# EAGLE schematic bontor_mbed_lowpan_rev_h (EAGLE 7.2.0)
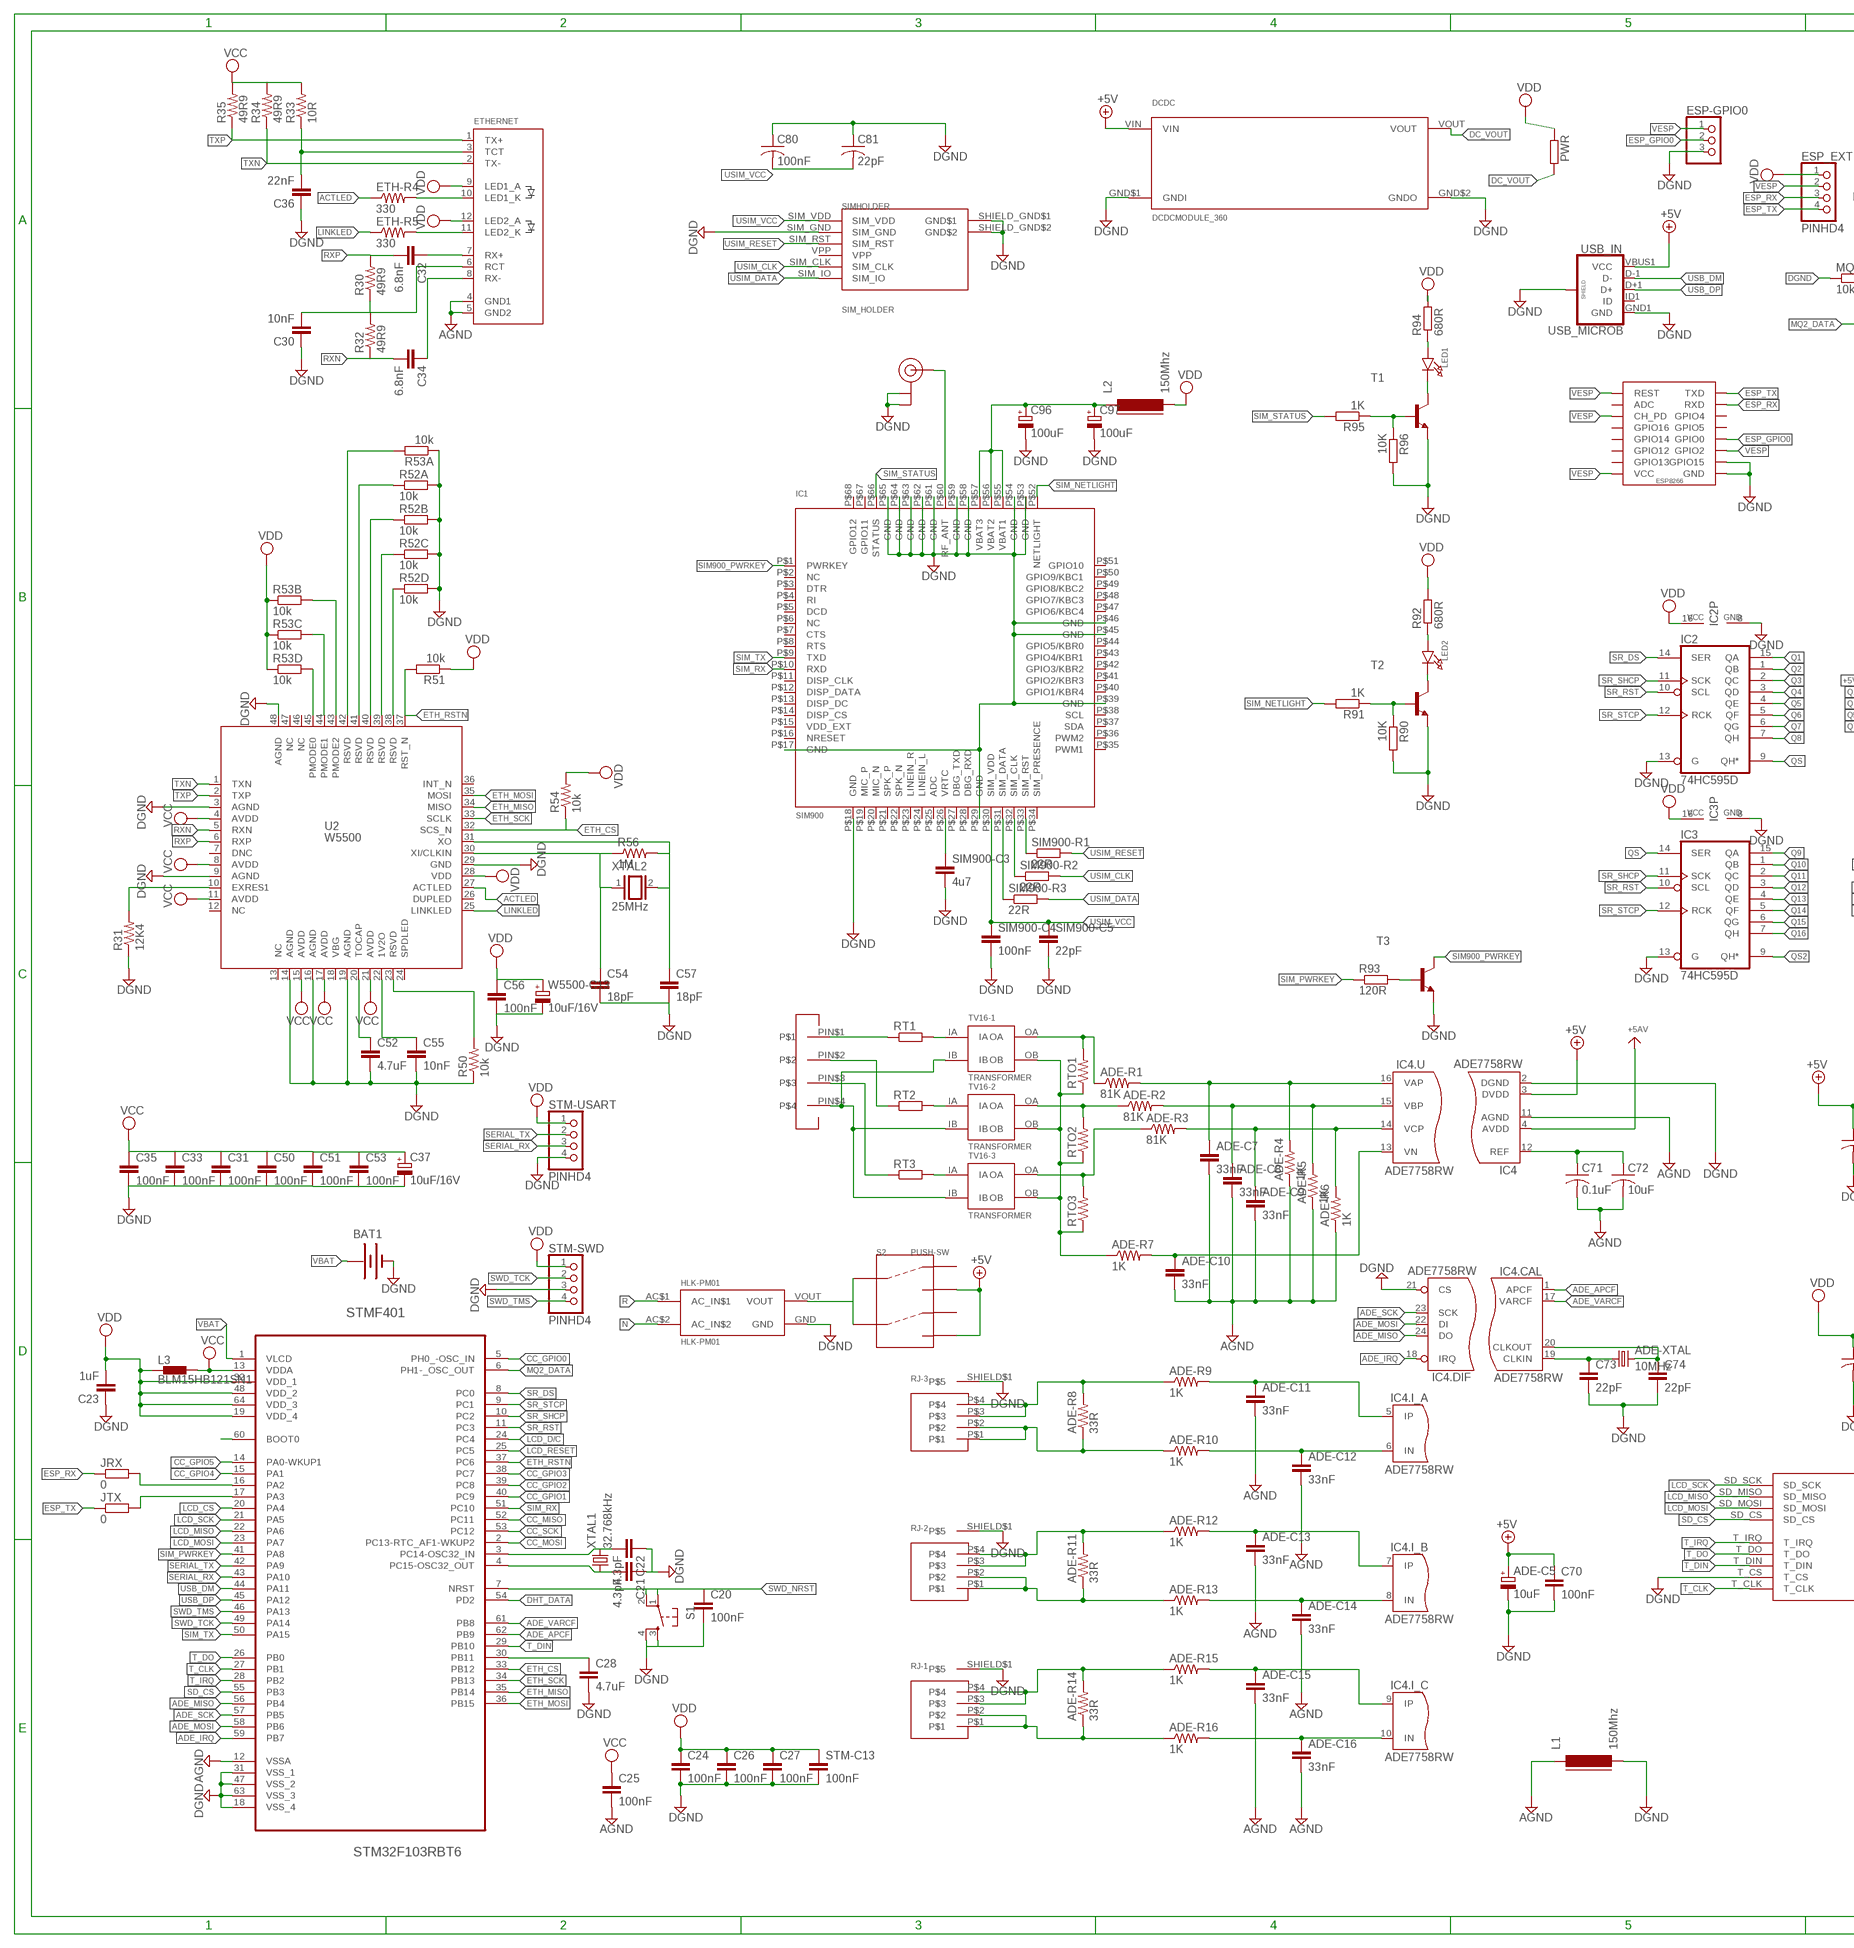
[diagram p0: schematic, sheet 1, part 1 of 2]
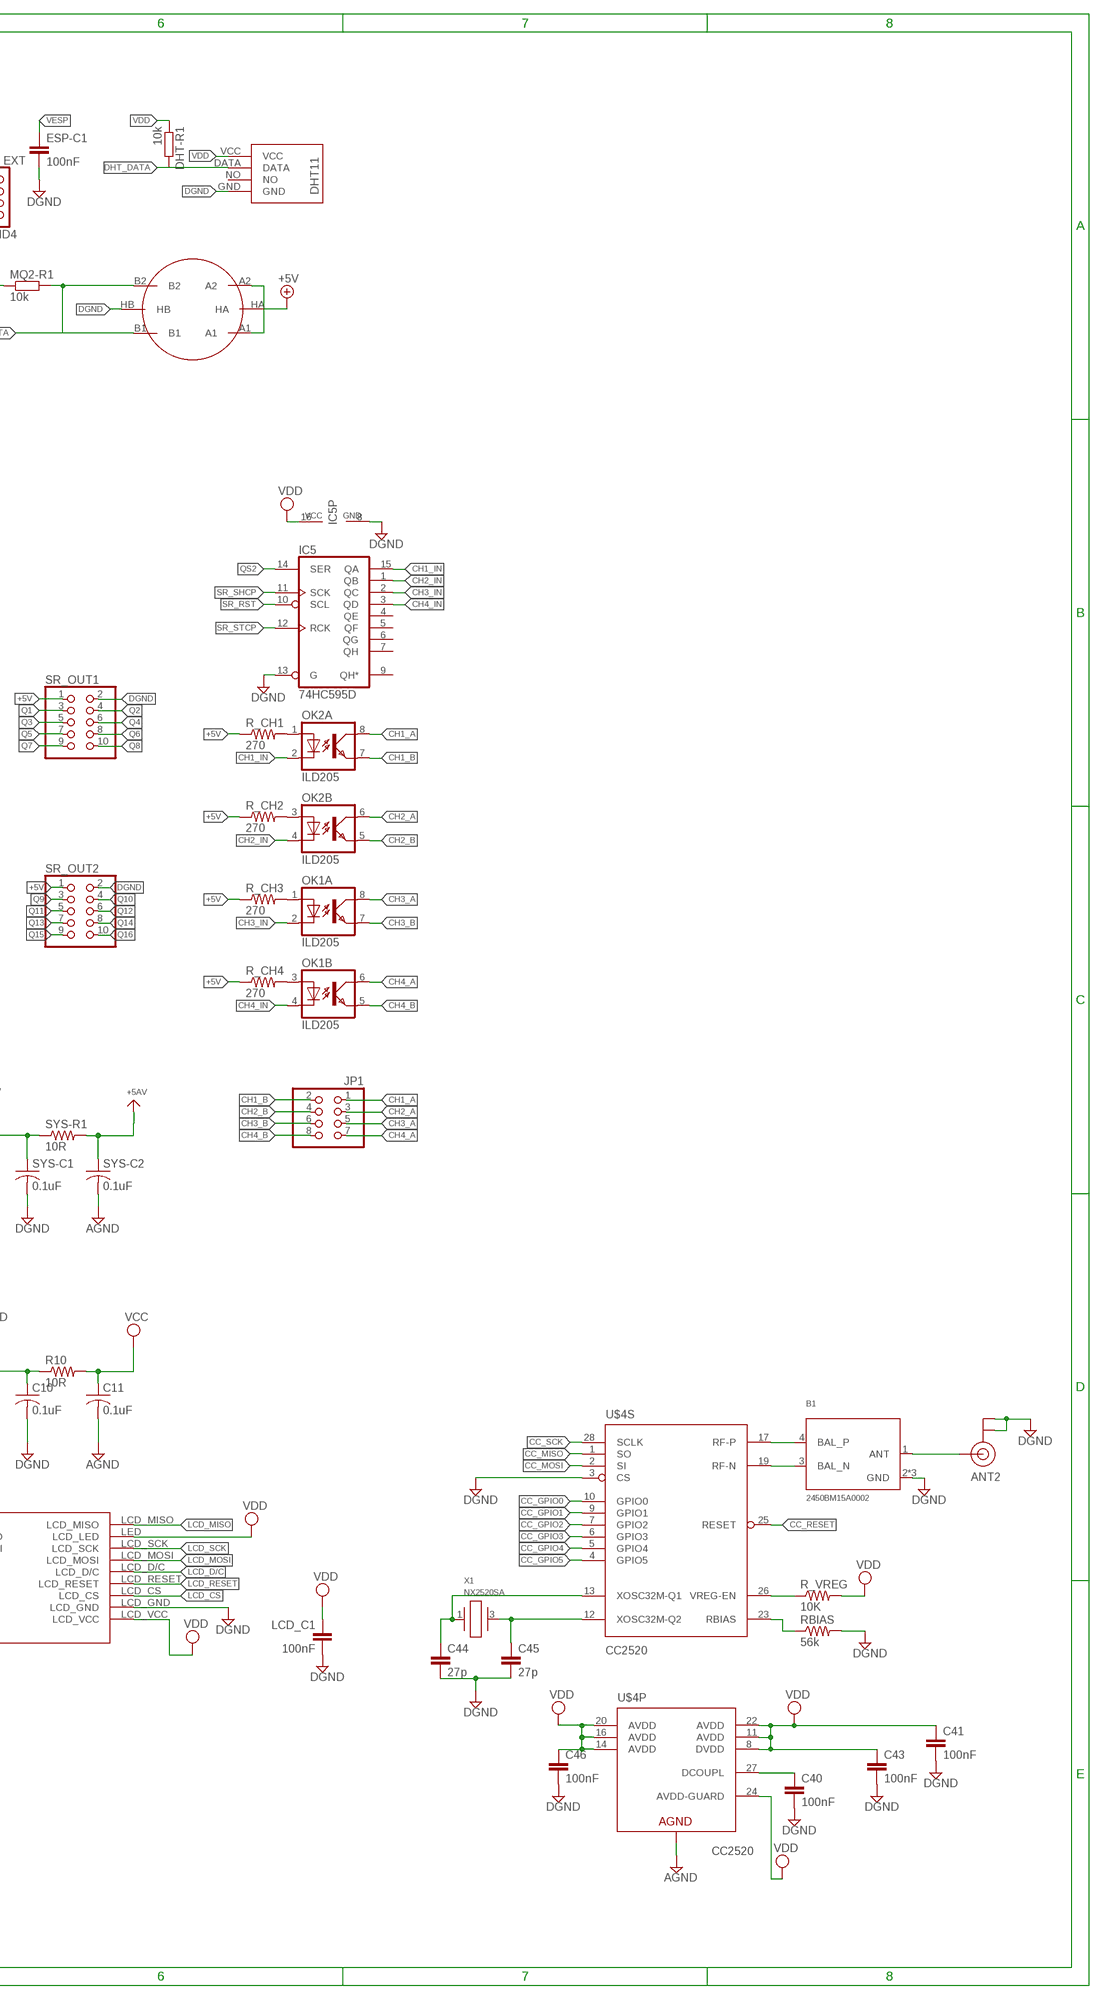
[diagram p1: schematic, sheet 1, part 2 of 2]

## Parts
ADE-C5  10uF  CPOL-EU153CLV-0605  [153CLV-0605]
ADE-C7  33nF  CAP0603-CAP  [0603-CAP]
ADE-C8  33nF  CAP0603-CAP  [0603-CAP]
ADE-C9  33nF  CAP0603-CAP  [0603-CAP]
ADE-C10  33nF  CAP0603-CAP  [0603-CAP]
ADE-C11  33nF  CAP0402-CAP  [0402-CAP]
ADE-C12  33nF  CAP0402-CAP  [0402-CAP]
ADE-C13  33nF  CAP0402-CAP  [0402-CAP]
ADE-C14  33nF  CAP0402-CAP  [0402-CAP]
ADE-C15  33nF  CAP0402-CAP  [0402-CAP]
ADE-C16  33nF  CAP0402-CAP  [0402-CAP]
ADE-R1  81K  RESISTOR0603-RES  [0603-RES]
ADE-R2  81K  RESISTOR0603-RES  [0603-RES]
ADE-R3  81K  RESISTOR0603-RES  [0603-RES]
ADE-R4  1K  RESISTOR0603-RES  [0603-RES]
ADE-R5  1K  RESISTOR0603-RES  [0603-RES]
ADE-R6  1K  RESISTOR0603-RES  [0603-RES]
ADE-R7  1K  RESISTOR0603-RES  [0603-RES]
ADE-R8  33R  RESISTOR0402-RES  [0402-RES]
ADE-R9  1K  RESISTOR0402-RES  [0402-RES]
ADE-R10  1K  RESISTOR0402-RES  [0402-RES]
ADE-R11  33R  RESISTOR0402-RES  [0402-RES]
ADE-R12  1K  RESISTOR0402-RES  [0402-RES]
ADE-R13  1K  RESISTOR0402-RES  [0402-RES]
ADE-R14  33R  RESISTOR0402-RES  [0402-RES]
ADE-R15  1K  RESISTOR0402-RES  [0402-RES]
ADE-R16  1K  RESISTOR0402-RES  [0402-RES]
ADE-XTAL  10MHz  CRYSTALHC49US  [HC49US]
ANT1  U.FL  [U.FL]
ANT2  U.FL  [U.FL]
B1  2450BM15A0002  [2450BM]
BAT1  BATTERY12MM  [BATTCON_12MM]
C10  0.1uF  C-USC0603  [C0603]
C11  0.1uF  C-USC0603  [C0603]
C20  100nF  C-EUC0603  [C0603]
C21  4.3pF  C-EUC0603  [C0603]
C22  4.3pF  C-EUC0603  [C0603]
C23  1uF  C-EUC0603  [C0603]
C24  100nF  C-EUC0603  [C0603]
C25  100nF  C-EUC0603  [C0603]
C26  100nF  C-EUC0603  [C0603]
C27  100nF  C-EUC0402  [C0402]
C28  4.7uF  C-EUC0603  [C0603]
C30  10nF  C-EUC0603  [C0603]
C31  100nF  C-EUC0603  [C0603]
C32  6.8nF  C-EUC0603  [C0603]
C33  100nF  C-EUC0603  [C0603]
C34  6.8nF  C-EUC0603  [C0603]
C35  100nF  C-EUC0603  [C0603]
C36  22nF  C-EUC0603  [C0603]
C37  10uF/16V  CPOL-EU153CLV-0605  [153CLV-0605]
C40  100nF  C-EUC0402  [C0402]
C41  100nF  C-EUC0402  [C0402]
C43  100nF  C-EUC0402  [C0402]
C44  27p  C-EUC0201  [C0201]
C45  27p  C-EUC0201  [C0201]
C46  100nF  C-EUC0402  [C0402]
C50  100nF  C-EUC0603  [C0603]
C51  100nF  C-EUC0603  [C0603]
C52  4.7uF  C-EUC0603  [C0603]
C53  100nF  C-EUC0603  [C0603]
C54  18pF  C-EUC0603  [C0603]
C55  10nF  C-EUC0603  [C0603]
C56  100nF  C-EUC0603  [C0603]
C57  18pF  C-EUC0603  [C0603]
C70  100nF  C-EUC0603  [C0603]
C71  0.1uF  C-USC0603  [C0603]
C72  10uF  C-USC0805K  [C0805K]
C73  22pF  C-EUC0603  [C0603]
C74  22pF  C-EUC0603  [C0603]
C80  100nF  C-USC0603K  [C0603K]
C81  22pF  C-USC0603K  [C0603K]
C96  100uF  CPOL-EU153CLV-0605  [153CLV-0605]
C97  100uF  CPOL-EU153CLV-0605  [153CLV-0605]
DCDC  DCDCMODULE_360  [DCDCMODULE-360]
DHT-R1  10k  R-EU_R0603  [R0603]
ESP  ESP  ESP8266WI12  [WI12]
ESP-C1  100nF  C-EUC0603  [C0603]
ESP-GPIO0  PINHD-1X3  [1X03]
ESP_EXT  PINHD4  [PINHD4]
ETH-R4  330  R-US_R0603  [R0603]
ETH-R5  330  R-US_R0603  [R0603]
ETHERNET  RJ45J0026D21BNL  [RJ45_PULSEJACK]
HLK-PM01  HLK-PM01  [HLK-PM01]
IC1  SIM900  GSM_SIM900_LITERAL  [SIM900_SMT]
IC2  74HC595D  [SO16]
IC3  74HC595D  [SO16]
IC4  ADE7758RW  [SOIC24]
IC5  74HC595D  [SO16]
JP1  PINHD-2X4  [2X04]
JRX  0  R-EU_R0603  [R0603]
JTX  0  R-EU_R0603  [R0603]
L1  150Mhz  FERRITE-0805  [FB805]
L2  150Mhz  FERRITE-0805  [FB805]
L3  BLM15HB121SN1  [0402]
LCD14  LCD_2.4  [LCD_TOUCH_2-4]
LCD_C1  100nF  C-EUC0603  [C0603]
LED1  LED0805_NOOUTLINE  [CHIPLED_0805_NOOUTLINE]
LED2  LED0805_NOOUTLINE  [CHIPLED_0805_NOOUTLINE]
MQ2-R1  10k  R-EU_R0603  [R0603]
OK1  ILD205  [SOIC08]
OK2  ILD205  [SOIC08]
PWR  R-EU_R0805  [R0805]
R10  10R  RESISTOR0603-RES  [0603-RES]
R30  49R9  R-US_R0603  [R0603]
R31  12K4  R-US_R0805  [R0805]
R32  49R9  R-US_R0603  [R0603]
R33  10R  R-US_R0603  [R0603]
R34  49R9  R-US_R0603  [R0603]
R35  49R9  R-US_R0603  [R0603]
R50  10k  R-US_R0603  [R0603]
R51  10k  R-EU_R0603  [R0603]
R52  10k  RESISTOR_ARRAY_4  [RN8P-4R-CRA06S]
R53  10k  RESISTOR_ARRAY_4  [RN8P-4R-CRA06S]
R54  10k  R-US_R0603  [R0603]
R56  1M  R-US_R0603  [R0603]
R90  10K  R-EU_R0603  [R0603]
R91  1K  R-EU_R0603  [R0603]
R92  680R  R-EU_R0603  [R0603]
R93  120R  R-EU_R0603  [R0603]
R94  680R  R-EU_R0603  [R0603]
R95  1K  R-EU_R0603  [R0603]
R96  10K  R-EU_R0603  [R0603]
R_CH1  270  RESISTOR0603-RES  [0603-RES]
R_CH2  270  RESISTOR0603-RES  [0603-RES]
R_CH3  270  RESISTOR0603-RES  [0603-RES]
R_CH4  270  RESISTOR0603-RES  [0603-RES]
R_VREG  10K  RESISTOR0402-RES  [0402-RES]
RBIAS  56k  RESISTOR0402-RES  [0402-RES]
RJ-1  RJ11-4P-V  [RJ11-4P-V]
RJ-2  RJ11-4P-V  [RJ11-4P-V]
RJ-3  RJ11-4P-V  [RJ11-4P-V]
RT1  R-EU_0309/V  [0309V]
RT2  R-EU_0309/V  [0309V]
RT3  R-EU_0309/V  [0309V]
RTO1  R-US_0309_12  [0309_12]
RTO2  R-US_0309_12  [0309_12]
RTO3  R-US_0309_12  [0309_12]
S1  TAC_SWITCHPTH  [TACTILE-PTH]
S2  PUSH-SW  SWITCH-6PIN-LOCK-2.54MM  [SWITCH-6PIN-LOCK-2.54MM]
SENSOR-MQ2  METHANE_SENSOR  [MQ-3]
SIM900-C3  4u7  C-EUC0603  [C0603]
SIM900-C4  100nF  C-EUC0603  [C0603]
SIM900-C5  22pF  C-EUC0603  [C0603]
SIM900-R1  22R  R-EU_R0603  [R0603]
SIM900-R2  22R  R-EU_R0603  [R0603]
SIM900-R3  22R  R-EU_R0603  [R0603]
SIMHOLDER  SIM_HOLDER  [SIMHOLDER-PUSHPUSH]
SR_OUT1  PINHD-2X5  [2X05]
SR_OUT2  PINHD-2X5  [2X05]
STM-C13  100nF  C-EUC0603  [C0603]
STM-SWD  PINHD4  [PINHD4]
STM-USART  PINHD4  [PINHD4]
STMF401  STM32F103RBT6  STM32L152RBT6  [QFP50P1200X1200X160-64N]
SYS-C1  0.1uF  C-USC0603  [C0603]
SYS-C2  0.1uF  C-USC0603  [C0603]
SYS-R1  10R  RESISTOR0603-RES  [0603-RES]
T1  MMBT2222ALT1-NPN-SOT23-BEC  [SOT23-BEC]
T2  MMBT2222ALT1-NPN-SOT23-BEC  [SOT23-BEC]
T3  MMBT2222ALT1-NPN-SOT23-BEC  [SOT23-BEC]
TERM_BLOCK  TERMINAL_BLOCK_TW  [TERMINAL-TWO-WAY]
TV16-1  TRANSFORMER  [TV16]
TV16-2  TRANSFORMER  [TV16]
TV16-3  TRANSFORMER  [TV16]
U2  W5500  [W5500]
U$4  CC2520  [QFN50P500X500X100-29N]
U$17  DHT11  [DHT11]
USB_IN  USB_MICROB  USB_MICROB_PLUGCONN-11752  [USB-B-MICRO-SMD_V03]
W5500-C13  10uF/16V  CPOL-EU153CLV-0605  [153CLV-0605]
X1  NX2520SA  [NX2520SA]
XTAL1  32.768kHz  CRYSTALTC26H  [TC26H]
XTAL2  25MHz  XTAL/S  [QS]

## Nets
+5V [power]: ADE-C5.+ C70.1 DCDC.VIN IC4.3(DVDD) R_CH1.1 R_CH2.1 R_CH3.1 R_CH4.1 S2.P$3 S2.P$6 SENSOR-MQ2.A1 SENSOR-MQ2.A2 SENSOR-MQ2.HA SR_OUT1.1 SR_OUT2.1 SYS-C1.1 SYS-R1.1 USB_IN.VBUS1(VCC)
ACTLED: ETH-R4.1 U2.27(ACTLED)
ADE_APCF: IC4.1(APCF) STMF401.62(PB9)
ADE_IRQ: IC4.18(IRQ) STMF401.59(PB7)
ADE_MISO: IC4.24(DO) STMF401.56(PB4)
ADE_MOSI: IC4.22(DI) STMF401.58(PB6)
ADE_SCK: IC4.23(SCK) STMF401.57(PB5)
ADE_VARCF: IC4.17(VARCF) STMF401.61(PB8)
AGND: ADE-C7.2 ADE-C8.2 ADE-C9.2 ADE-C10.2 ADE-C11.2 ADE-C12.2 ADE-C13.2 ADE-C14.2 ADE-C15.2 ADE-C16.2 ADE-R4.1 ADE-R5.1 ADE-R6.1 C11.2 C25.2 C71.2 C72.2 ETHERNET.4(GND1) ETHERNET.5(GND2) IC4.11(AGND) L1.1 STMF401.12(VSSA) SYS-C2.2 U$4.29(P:AGND)
AVDD: IC4.4(AVDD) SYS-C2.1 SYS-R1.2 ; supply symbol labelled +5AV
CC_GPIO0: STMF401.5(PH0_-OSC_IN) U$4.10(S:GPIO0)
CC_GPIO1: STMF401.40(PC9) U$4.9(S:GPIO1)
CC_GPIO2: STMF401.39(PC8) U$4.7(S:GPIO2)
CC_GPIO3: STMF401.38(PC7) U$4.6(S:GPIO3)
CC_GPIO4: STMF401.15(PA1) U$4.5(S:GPIO4)
CC_GPIO5: STMF401.14(PA0-WKUP1) U$4.4(S:GPIO5)
CC_MISO: STMF401.52(PC11) U$4.1(S:SO)
CC_MOSI: STMF401.2(PC13-RTC_AF1-WKUP2) U$4.2(S:SI)
CC_RESET: U$4.25(S:RESET)
CC_SCK: STMF401.53(PC12) U$4.28(S:SCLK)
CH1_A: JP1.1 OK2.8(A:COL)
CH1_B: JP1.2 OK2.7(A:EMIT)
CH1_IN: IC5.15(QA) OK2.2(A:C)
CH2_A: JP1.3 OK2.6(B:COL)
CH2_B: JP1.4 OK2.5(B:EMIT)
CH2_IN: IC5.1(QB) OK2.4(B:C)
CH3_A: JP1.5 OK1.8(A:COL)
CH3_B: JP1.6 OK1.7(A:EMIT)
CH3_IN: IC5.2(QC) OK1.2(A:C)
CH4_A: JP1.7 OK1.6(B:COL)
CH4_B: JP1.8 OK1.5(B:EMIT)
CH4_IN: IC5.3(QD) OK1.4(B:C)
DC_VOUT: DCDC.VOUT PWR.2
DGND: ADE-C5.- ANT1.P$1(GND) ANT1.P$2(GND) ANT2.P$1(GND) ANT2.P$2(GND) B1.2(GND) B1.5(GND) B1.6(GND) BAT1.GND(-) C10.2 C20.2 C21.1 C22.1 C23.1 C24.2 C26.2 C27.2 C28.2 C30.1 C31.2 C33.2 C35.2 C36.1 C37.- C40.2 C41.2 C43.2 C44.2 C45.2 C46.2 C50.2 C51.2 C52.2 C53.2 C54.2 C55.2 C56.2 C57.2 C70.2 C73.2 C74.2 C80.1 C81.1 C96.- C97.- DCDC.GND$1(GNDI) DCDC.GND$2(GNDO) ESP-C1.2 ESP-GPIO0.3 ESP.GND ESP.GPIO15 HLK-PM01.GND IC1.P$17(GND) IC1.P$18(GND) IC1.P$29(GND) IC1.P$39(GND) IC1.P$45(GND) IC1.P$46(GND) IC1.P$53(GND) IC1.P$54(GND) IC1.P$58(GND) IC1.P$59(GND) IC1.P$61(GND) IC1.P$62(GND) IC1.P$63(GND) IC1.P$64(GND) IC1.P$65(GND) IC2.8(GND) IC2.13(G) IC3.8(GND) IC3.13(G) IC4.2(DGND) IC4.21(CS) IC5.8(GND) IC5.13(G) L1.2 LCD14.LCD_GND LCD14.T_CS LCD_C1.2 MQ2-R1.1 R31.1 R50.1 R52.5 R52.6 R52.7 R52.8 R53.1 R90.2 R96.2 RBIAS.2 RJ-1.SHIELD$1 RJ-2.SHIELD$1 RJ-3.SHIELD$1 S1.3 S1.4 SENSOR-MQ2.HB SIM900-C3.2 SIM900-C4.2 SIM900-C5.2 SIMHOLDER.SHIELD_GND$1(GND$1) SIMHOLDER.SHIELD_GND$2(GND$2) SIMHOLDER.SIM_GND SR_OUT1.2 SR_OUT2.2 STM-C13.2 STM-SWD.3 STM-USART.4 STMF401.18(VSS_4) STMF401.31(VSS_1) STMF401.47(VSS_2) STMF401.63(VSS_3) SYS-C1.2 T1.E T2.E T3.E U2.3(AGND) U2.9(AGND) U2.14(AGND) U2.16(AGND) U2.19(AGND) U2.29(GND) U2.48(AGND) U$4.3(S:CS) U$17.GND USB_IN.GND1(GND) USB_IN.SHIELD1(SHIELD) USB_IN.SHIELD2(SHIELD) USB_IN.SHIELD3(SHIELD) W5500-C13.-
DHT_DATA: DHT-R1.2 STMF401.54(PD2) U$17.DATA
ESP_GPIO0: ESP-GPIO0.2 ESP.GPIO00(GPIO0)
ESP_RX: ESP.RXD ESP_EXT.3 JRX.1
ESP_TX: ESP.TXD ESP_EXT.4 JTX.1
ETH_CS: R54.1 STMF401.33(PB12) U2.32(SCS_N)
ETH_MISO: STMF401.35(PB14) U2.34(MISO)
ETH_MOSI: STMF401.36(PB15) U2.35(MOSI)
ETH_RSTN: R51.2 STMF401.37(PC6) U2.37(RST_N)
ETH_SCK: STMF401.34(PB13) U2.33(SCLK)
IBN: ADE-R11.1 ADE-R13.1 RJ-2.P$1 RJ-2.P$2
ICN: ADE-R14.1 ADE-R16.1 RJ-1.P$1 RJ-1.P$2
LCD_CS: LCD14.LCD_CS STMF401.20(PA4)
LCD_D/C: LCD14.LCD_D/C STMF401.24(PC4)
LCD_MISO: LCD14.LCD_MISO LCD14.SD_MISO STMF401.22(PA6)
LCD_MOSI: LCD14.LCD_MOSI LCD14.SD_MOSI STMF401.23(PA7)
LCD_RESET: LCD14.LCD_RESET STMF401.25(PC5)
LCD_SCK: LCD14.LCD_SCK LCD14.SD_SCK STMF401.21(PA5)
LINKLED: ETH-R5.1 U2.25(LINKLED)
MQ2_DATA: MQ2-R1.2 SENSOR-MQ2.B1 SENSOR-MQ2.B2 STMF401.6(PH1-_OSC_OUT)
N: HLK-PM01.AC$2(AC_IN$2) TERM_BLOCK.PIN$4 TV16-1.IB TV16-2.IB TV16-3.IB
N$1: C22.2 STMF401.3(PC14-OSC32_IN) XTAL1.2
N$2: C21.2 STMF401.4(PC15-OSC32_OUT) XTAL1.1
N$3: IC1.P$31(SIM_DATA) SIM900-R3.1
N$5: OK2.1(A:A) R_CH1.2
N$6: OK2.3(B:A) R_CH2.2
N$7: OK1.1(A:A) R_CH3.2
N$8: IC1.P$32(SIM_CLK) SIM900-R2.1
N$9: R_VREG.1 U$4.26(S:VREG-EN)
N$10: ADE-C9.1 ADE-R3.2 ADE-R6.2 IC4.14(VCP)
N$11: ETH-R4.2 ETHERNET.10(LED1_K)
N$12: ETH-R5.2 ETHERNET.11(LED2_K)
N$13: IC1.P$33(SIM_RST) SIM900-R1.1
N$14: IC1.P$26(VRTC) SIM900-C3.1
N$15: ANT1.P$3(SIGNAL) IC1.P$60(RF_ANT)
N$16: LED1.A R94.1
N$17: LED1.C T1.C
N$18: R95.1 R96.1 T1.B
N$19: LED2.A R92.1
N$20: LED2.C T2.C
N$21: R90.1 R91.1 T2.B
N$22: C32.1 ETHERNET.7(RX+)
N$23: C36.2 ETHERNET.3(TCT) R33.1
N$24: ADE-C15.1 ADE-R15.2 IC4.9(IP)
N$25: ADE-R11.2 ADE-R12.1 RJ-2.P$3 RJ-2.P$4
N$26: C34.1 ETHERNET.8(RX-)
N$27: ADE-C11.1 ADE-R9.2 IC4.5(IP)
N$28: ADE-C12.1 ADE-R10.2 IC4.6(IN)
N$29: C30.2 ETHERNET.6(RCT) R30.1 R32.2
N$30: ADE-C14.1 ADE-R13.2 IC4.8(IN)
N$31: ADE-C13.1 ADE-R12.2 IC4.7(IP)
N$32: C71.1 C72.1 IC4.12(REF)
N$33: ADE-XTAL.1 C73.1 IC4.19(CLKIN)
N$34: ADE-XTAL.2 C74.1 IC4.20(CLKOUT)
N$35: ADE-C10.1 ADE-R7.2 IC4.13(VN)
N$36: ADE-R2.1 RTO2.2 TV16-2.OA
N$37: ADE-C8.1 ADE-R2.2 ADE-R5.2 IC4.15(VBP)
N$38: C52.1 U2.20(TOCAP)
N$39: ADE-R8.2 ADE-R9.1 RJ-3.P$3 RJ-3.P$4
N$40: ADE-C16.1 ADE-R16.2 IC4.10(IN)
N$41: C55.1 U2.22(1V2O)
N$42: R50.2 U2.23(RSVD)
N$43: C40.1 U$4.27(P:DCOUPL)
N$44: R93.2 T3.B
N$45: STMF401.60(BOOT0)
N$46: OK1.3(B:A) R_CH4.2
N$47: ADE-R8.1 ADE-R10.1 RJ-3.P$1 RJ-3.P$2
N$48: ADE-R14.2 ADE-R15.1 RJ-1.P$3 RJ-1.P$4
N$50: C57.1 R56.2 U2.31(XO) XTAL2.2
N$51: R31.2 U2.10(EXRES1)
N$52: ADE-C7.1 ADE-R1.2 ADE-R4.2 IC4.16(VAP)
N$54: ADE-R1.1 RTO1.2 TV16-1.OA
N$55: ADE-R7.1 RTO1.1 RTO2.1 RTO3.1 TV16-1.OB TV16-2.OB TV16-3.OB
N$57: R52.4 U2.38(RSVD)
N$58: R52.3 U2.39(RSVD)
N$59: R52.2 U2.40(RSVD)
N$60: R52.1 U2.41(RSVD)
N$61: R53.8 U2.42(RSVD)
N$62: R53.7 U2.43(PMODE2)
N$63: R53.6 U2.44(PMODE1)
N$64: R53.5 U2.45(PMODE0)
N$65: ADE-R3.1 RTO3.2 TV16-3.OA
N$66: C54.1 R56.1 U2.30(XI/CLKIN) XTAL2.1
N$68: C96.+ C97.+ IC1.P$55(VBAT1) IC1.P$56(VBAT2) IC1.P$57(VBAT3) L2.1
N$69: C44.1 U$4.13(S:XOSC32M-Q1) X1.1
N$70: C45.1 U$4.12(S:XOSC32M-Q2) X1.3
N$71: JRX.2 STMF401.16(PA2)
N$72: JTX.2 STMF401.17(PA3)
N$73: RT3.2 TV16-3.IA
N$74: RT2.2 TV16-2.IA
N$75: RT1.2 TV16-1.IA
N$76: RBIAS.1 U$4.23(S:RBIAS)
N$77: C28.1 STMF401.30(PB11)
N$78: B1.4(BAL_P) U$4.17(S:RF-P)
N$79: HLK-PM01.VOUT S2.P$1 S2.P$4
N$82: B1.3(BAL_N) U$4.19(S:RF-N)
N$83: ANT2.P$3(SIGNAL) B1.1(ANT)
Q1: IC2.15(QA) SR_OUT1.3
Q2: IC2.1(QB) SR_OUT1.4
Q3: IC2.2(QC) SR_OUT1.5
Q4: IC2.3(QD) SR_OUT1.6
Q5: IC2.4(QE) SR_OUT1.7
Q6: IC2.5(QF) SR_OUT1.8
Q7: IC2.6(QG) SR_OUT1.9
Q8: IC2.7(QH) SR_OUT1.10
Q9: IC3.15(QA) SR_OUT2.3
Q10: IC3.1(QB) SR_OUT2.4
Q11: IC3.2(QC) SR_OUT2.5
Q12: IC3.3(QD) SR_OUT2.6
Q13: IC3.4(QE) SR_OUT2.7
Q14: IC3.5(QF) SR_OUT2.8
Q15: IC3.6(QG) SR_OUT2.9
Q16: IC3.7(QH) SR_OUT2.10
QS: IC2.9(QH*) IC3.14(SER)
QS2: IC3.9(QH*) IC5.14(SER)
R: HLK-PM01.AC$1(AC_IN$1) RT1.1 TERM_BLOCK.PIN$1
RXN: C34.2 R32.1 U2.5(RXN)
RXP: C32.2 R30.2 U2.6(RXP)
S: RT2.1 TERM_BLOCK.PIN$2
SD_CS: LCD14.SD_CS STMF401.55(PB3)
SERIAL_RX: STM-USART.3 STMF401.43(PA10)
SERIAL_TX: STM-USART.2 STMF401.42(PA9)
SIM900_PWRKEY: IC1.P$1(PWRKEY) T3.C
SIM_NETLIGHT: IC1.P$52(NETLIGHT) R91.2
SIM_PWRKEY: R93.1 STMF401.41(PA8)
SIM_RX: IC1.P$10(RXD) STMF401.51(PC10)
SIM_STATUS: IC1.P$66(STATUS) R95.2
SIM_TX: IC1.P$9(TXD) STMF401.50(PA15)
SR_DS: IC2.14(SER) STMF401.8(PC0)
SR_RST: IC2.10(SCL) IC3.10(SCL) IC5.10(SCL) STMF401.11(PC3)
SR_SHCP: IC2.11(SCK) IC3.11(SCK) IC5.11(SCK) STMF401.10(PC2)
SR_STCP: IC2.12(RCK) IC3.12(RCK) IC5.12(RCK) STMF401.9(PC1)
SWD_NRST: C20.1 S1.1 S1.2 STMF401.7(NRST)
SWD_TCK: STM-SWD.2 STMF401.49(PA14)
SWD_TMS: STM-SWD.4 STMF401.46(PA13)
T: RT3.1 TERM_BLOCK.PIN$3
T_CLK: LCD14.T_CLK STMF401.27(PB1)
T_DIN: LCD14.T_DIN STMF401.29(PB10)
T_DO: LCD14.T_DO STMF401.26(PB0)
T_IRQ: LCD14.T_IRQ STMF401.28(PB2)
TXN: ETHERNET.2(TX-) R34.1 U2.1(TXN)
TXP: ETHERNET.1(TX+) R35.1 U2.2(TXP)
USB_DM: STMF401.44(PA11) USB_IN.D-1(D-)
USB_DP: STMF401.45(PA12) USB_IN.D+1(D+)
USIM_CLK: SIM900-R2.2 SIMHOLDER.SIM_CLK
USIM_DATA: SIM900-R3.2 SIMHOLDER.SIM_IO
USIM_RESET: SIM900-R1.2 SIMHOLDER.SIM_RST
USIM_VCC: C80.2 C81.2 IC1.P$30(SIM_VDD) SIM900-C4.1 SIM900-C5.1 SIMHOLDER.SIM_VDD
VBAT: BAT1.PWR@1(+) STMF401.1(VLCD)
VCC: C11.1 C25.1 C31.1 C33.1 C35.1 C37.+ C50.1 C51.1 C53.1 L3.2 R10.2 R33.2 R34.2 R35.2 STMF401.13(VDDA) U2.4(AVDD) U2.8(AVDD) U2.11(AVDD) U2.15(AVDD) U2.17(AVDD) U2.21(AVDD)
VDD: C10.1 C23.2 C24.1 C26.1 C27.1 C41.1 C43.1 C46.1 C56.1 DHT-R1.1 ESP_EXT.1 ETHERNET.9(LED1_A) ETHERNET.12(LED2_A) IC2.16(VCC) IC3.16(VCC) IC5.16(VCC) L2.2 L3.1 LCD14.LCD_VCC LCD14.LED(LCD_LED) LCD_C1.1 PWR.1 R10.1 R51.1 R53.2 R53.3 R53.4 R54.2 R92.2 R94.2 R_VREG.2 STM-C13.1 STM-SWD.1 STM-USART.1 STMF401.19(VDD_4) STMF401.32(VDD_1) STMF401.48(VDD_2) STMF401.64(VDD_3) U2.28(VDD) U$4.8(P:DVDD) U$4.11(P:AVDD) U$4.14(P:AVDD) U$4.16(P:AVDD) U$4.20(P:AVDD) U$4.22(P:AVDD) U$4.24(P:AVDD-GUARD) U$17.VCC W5500-C13.+
VESP: ESP-C1.1 ESP-GPIO0.1 ESP.CH_PD ESP.GPIO02(GPIO2) ESP.REST ESP.VCC ESP_EXT.2
Unconnected: ESP.ADC ESP.GPIO04(GPIO4) ESP.GPIO05(GPIO5) ESP.GPIO12 ESP.GPIO13 ESP.GPIO14 ESP.GPIO16 IC1.P$2(NC) IC1.P$3(DTR) IC1.P$4(RI) IC1.P$5(DCD) IC1.P$6(NC) IC1.P$7(CTS) IC1.P$8(RTS) IC1.P$11(DISP_CLK) IC1.P$12(DISP_DATA) IC1.P$13(DISP_DC) IC1.P$14(DISP_CS) IC1.P$15(VDD_EXT) IC1.P$16(NRESET) IC1.P$19(MIC_P) IC1.P$20(MIC_N) IC1.P$21(SPK_P) IC1.P$22(SPK_N) IC1.P$23(LINEIN_R) IC1.P$24(LINEIN_L) IC1.P$25(ADC) IC1.P$27(DBG_TXD) IC1.P$28(DBG_RXD) IC1.P$34(SIM_PRESENCE) IC1.P$35(PWM1) IC1.P$36(PWM2) IC1.P$37(SDA) IC1.P$38(SCL) IC1.P$40(GPIO1/KBR4) IC1.P$41(GPIO2/KBR3) IC1.P$42(GPIO3/KBR2) IC1.P$43(GPIO4/KBR1) IC1.P$44(GPIO5/KBR0) IC1.P$47(GPIO6/KBC4) IC1.P$48(GPIO7/KBC3) IC1.P$49(GPIO8/KBC2) IC1.P$50(GPIO9/KBC1) IC1.P$51(GPIO10) IC5.4(QE) IC5.5(QF) IC5.6(QG) IC5.7(QH) IC5.9(QH*) S2.P$2 S2.P$5 SIMHOLDER.VPP U2.7(DNC) U2.12(NC) U2.13(NC) U2.18(VBG) U2.24(SPDLED) U2.26(DUPLED) U2.36(INT_N) U2.46(NC) U2.47(NC) U$4.15(NC) U$4.18(NC) U$4.21(NC) U$17.NO USB_IN.ID1(ID)

## Power pins joined to a net without a drawn wire
GPIO11: IC1.P$67(GPIO11)
GPIO12: IC1.P$68(GPIO12)

## Library data of the parts
ADE-C5 C37 C96 C97 W5500-C13 = rcl:CPOL-EU: POLARIZED CAPACITOR, European symbol
ADE-C7-ADE-C16 = SparkFun-Passives:CAP: Capacitor Standard 0603 ceramic capacitor, and 0.1" leaded capacitor.
ADE-R1-ADE-R16 R10 R_CH1-R_CH4 R_VREG RBIAS SYS-R1 = SparkFun-Passives:RESISTOR: Resistor Basic schematic elements and footprints for 0603, 1206, and PTH resistors.
ADE-XTAL XTAL1 = SparkFun-FreqCtrl:CRYSTAL: Various standard crystals. Proven footprints. Spark Fun Electronics SKU : COM-00534
ANT1 = SparkFun:U.FL
ANT2 = SparkFun-Connectors:U.FL: SMD antenna connector- WRL-09144; PROD_ID: CONN-09193
B1 = rpi-cc2520:2450BM15A0002: BALUN JTI MATCHED ZIGBEE; DIGIKEY: 712-1536-1-ND
BAT1 = SparkFun-Electromechanical:BATTERY: Battery Holders Various common sizes : AA, AAA, 20mm coin cell and 12mm coin cell. 20MM_4LEGS, BATT-10373; PROD_ID: BATT-08044
C10 C11 C71 C72 C80 C81 SYS-C1 SYS-C2 = rcl:C-US: CAPACITOR, American symbol
C20-C28 C30-C36 C40 C41 C43-C46 C50-C57 C70 C73 C74 ESP-C1 LCD_C1 SIM900-C3-SIM900-C5 STM-C13 = rcl:C-EU: CAPACITOR, European symbol
DCDC = bontor:DCDCMODULE_360
DHT-R1 MQ2-R1 R93 = resistor:R-EU_: RESISTOR, European symbol
ESP = esp8266:ESP8266
ESP-GPIO0 = adafruit:PINHD-1X3: PIN HEADER
ESP_EXT STM-SWD STM-USART = TFT_LCD_2.2:PINHD4: Pin Head 1x4 Holes 2.54 mm
ETH-R4 ETH-R5 R30-R35 R50 R54 R56 = resistor:R-US_: RESISTOR, American symbol
ETHERNET = microbuilder:RJ45: RJ45 (Ethernet) Connectors J0026D21BNL - RJ45 Connector with internal transformer and 2 LEDs (Yellow/Green). LEDs have max foreward-voltage of 2.5V. LEDs require an external resistor. Digikey: 553-1349-ND J00-0065NL - RJ45 Connector with internal transformer and 2 LEDs (Yellow/Green). LEDs have max foreward-voltage of 2.5V. LEDs require an external resistor. Digikey: 553-1345-ND
HLK-PM01 = bontor:HLK-PM01
IC1 = microbuilder:GSM_SIM900_LITERAL: SIM900 Quad-Band GSM/GPRS Module Power Supply: 3.2-4.8V Temperature Range: -30°C-+80°C Bands: GSM 850, EGSM 900, DCS 1800, PCS 1900
IC2 IC3 IC5 = 74xx-eu:74*595: 8-bit SHIFT REGISTER, output latch
IC4 = ade7758:ADE7758: Poly Phase Multifunction Energy Metering IC with Per Phase Information FEATURES Highly accurate; supports IEC 60687, IEC 61036, IEC 61268, IEC 62053-21, IEC 62053-22, and IEC 62053-23 Compatible with 3-phase/3-wire, 3-phase/4-wire, and other 3-phase services Less than 0.1% active energy error over a dynamic range of 1000 to 1 at 25°C Supplies active/reactive/apparent energy, voltage rms, current rms, and sampled waveform data Two pulse outputs, one for active power and the other selectable between reactive and apparent power with programmable frequency Digital power, phase, and rms offset calibration On-chip, user-programmable thresholds for line voltage SAG and overvoltage detections An on-chip, digital integrator enables direct interface-to-current sensors with di/dt output A PGA in the current channel allows direct interface to shunts and current transformers An SPI®-compatible serial interface with IRQ Proprietary ADCs and DSP provide high accuracy over large variations in environmental conditions and time Reference 2.4 V (drift 30 ppm/°C typical) with external overdrive capability Single 5 V supply, low power (70 mW typical)
JP1 = pinhead:PINHD-2X4: PIN HEADER
JRX JTX PWR R51 R90-R92 R94-R96 RT1-RT3 SIM900-R1-SIM900-R3 = rcl:R-EU_: RESISTOR, European symbol
L1 L2 = dp_devices:FERRITE: Ferrite bead in various packages
L3 = inductors:BLM15H: EMIFIL (R) Chip Ferrite Bead for GHz Noise Source: http://www.murata.com/ Ferrite Bead BLM15H.pdf
LCD14 = bontor:LCD_2.4
LED1 LED2 = microbuilder:LED: LED 0603 - 0603 Surface Mount Package 2mA: Green LED - Low Power (3.9mcd, 2ma, 1.7Vf) - Digikey: 475-2709-2-ND Orange LED - Low Power (9.8mcd, 2ma, 1.8Vf) - Digikey: 475-1194-2-ND Red LED - Low Power (5mcd, 2ma, 1.8Vf) - Digikey: 475-1195-2-ND Yellow LED - Low Power (7mcd, 2ma, 1.8Vf) - Digikey: 475-1196-2-ND 5mA: Blue LED - Low Power (17mcd, 5ma, 2.9Vf) - Digikey: LNJ937W8CRACT-ND 0805 - 0805 Surface Mount Package 2mA: Red LED (8.8mcd, 2mA, 1.8Vf, Clear) - Low Power [Digikey: 475-2510-1-ND] Green LED (5mcd, 2mA, 1.8Vf, Clear) - Low Power [Digikey: 475-2730-1-ND] Yellow LED (11.3mcd, 2mA, 1.8Vf, Clear) - Low Power [Digikey: 475-2555-1-ND] 20mA: Red LED (104mcd, 20mA, Diffused) - LS R976 [Digikey: 475-1278-6-ND] Red LED (12mcd, 20mA, 2.0Vf, Clear) - APT2012EC [Digikey: 754-1128-1-ND] Green LED (15mcd, 20mA, 2.2Vf, Clear) - APT2012GC [Digikey: 754-1131-1-ND] Orange LED (160mcd, 20mA, 2.1Vf, Clear) - APT2012SECK [Digikey: 754-1130-1-ND] 1206 - 1206 Surface Mount Package Green LED (26mcd, 20mA, Diffused) - LG N971 [Digikey: 475-1407-6-ND] Red LED (15mcd, 20mA, Diffused) - LH N974 [Digikey: 475-1416-6-ND]
OK1 OK2 = optocoupler:ILD2*: Siemens ILD205/206/207/211/213/217 DUAL PHOTOTRANSISTOR SMALL OUTLINE SURFACE MOUNT OPTOCOUPLER Source: 153385-da-01-en-Optocoupler_ILD205-T.pdf; MF: VISHAY/TELEFUNKEN; MPN: ILD205T; OC_FARNELL: 1469512; OC_NEWARK: 20H8678
R52 R53 = dp_devices:RESISTOR_ARRAY_4: 4 Resistor Array 0603
RJ-1-RJ-3 = bontor:RJ11-4P-V
RTO1-RTO3 = rcl:R-US_: RESISTOR, American symbol
S1 = SparkFun-Electromechanical:TAC_SWITCH: Momentary Switch Button commonly used for reset or general input. Spark Fun Electronics SKU : COM-00097 SMT- SWCH-08247
S2 = Itead_BP_110825:SWITCH-6PIN-LOCK-2.54MM: SOC016
SENSOR-MQ2 = SparkFun-Sensors:METHANE_SENSOR: MQ-4 Methane Gas Sensor SEN-09404
SIMHOLDER = bontor:SIM_HOLDER
SR_OUT1 SR_OUT2 = pinhead:PINHD-2X5: PIN HEADER
STMF401 = ST Microelctronics_By_element14_Batch_1:STM32L152RBT6: Ultralow power ARM-based 32-bit MCU; MPN: STM32L152RBT6; OC_FARNELL: 2060946; OC_NEWARK: 65T3806; PACKAGE: QTP-64; SUPPLIER: STMICROELECTRONICS
T1 T2 = transistor:*-NPN-: NPN Transistror BF959 corrected 2008.03.06
T3 = transistor-neu-to92:*-NPN-: NPN Transistror BF959 corrected 2008.03.06
TERM_BLOCK = bontor:TERMINAL_BLOCK_TW
TV16-1-TV16-3 = bontor:TRANSFORMER
U2 = W5500:W5500
U$4 = chipcon-ti-v2:CC2520: 2.4 GHZ IEEE 802.15.4/ZIGBEE® RF TRANSCEIVER
U$17 = DHT11:DHT11: DHT11 Czujnik temperatury i wilgotności
USB_IN = SparkFun-Connectors:USB_MICROB_PLUG: USB Micro-B connectors Some male, some female. Watch your step!; PROD_ID: CONN-11752
X1 = bbb-cc2520:NX2520SA: CRYSTAL 32MHZ 10PF SMD; DIGIKEY: 644-1065-1-ND
XTAL2 = special:XTAL/S: CRYSTAL

## Net classes
1 power: width 0.305 mm, drill 0.6 mm, clearance 0.254 mm
2 gnd: width 0.254 mm, drill 0.6 mm, clearance 0.254 mm